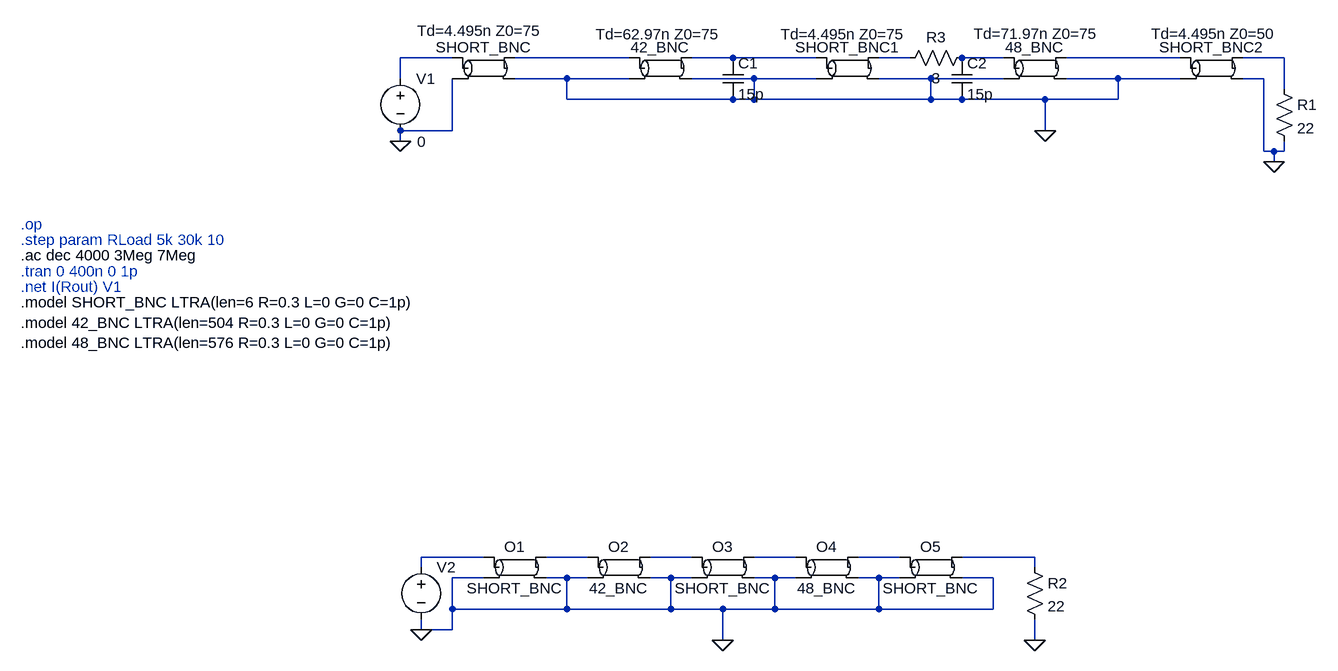
[diagram p0: schematic 4b_matched.asc]
4b_matched.asc, the LTspice schematic file:
Version 4.1
SHEET 1 2820 1172
WIRE 1488 256 1408 256
WIRE 1760 256 1584 256
WIRE 1920 256 1856 256
WIRE 2048 256 1920 256
WIRE 2192 256 2144 256
WIRE 2336 256 2272 256
WIRE 2608 256 2432 256
WIRE 2768 256 2704 256
WIRE 1408 288 1408 256
WIRE 1664 288 1584 288
WIRE 1760 288 1664 288
WIRE 1952 288 1856 288
WIRE 2048 288 1952 288
WIRE 2224 288 2144 288
WIRE 2336 288 2224 288
WIRE 2512 288 2432 288
WIRE 2608 288 2512 288
WIRE 2736 288 2704 288
WIRE 2768 304 2768 256
WIRE 1664 320 1664 288
WIRE 1920 320 1664 320
WIRE 1952 320 1952 288
WIRE 1952 320 1920 320
WIRE 2224 320 2224 288
WIRE 2224 320 1952 320
WIRE 2272 320 2224 320
WIRE 2400 320 2272 320
WIRE 2512 320 2512 288
WIRE 2512 320 2400 320
WIRE 1488 368 1488 288
WIRE 1488 368 1408 368
WIRE 2400 368 2400 320
WIRE 1408 384 1408 368
WIRE 2736 400 2736 288
WIRE 2752 400 2736 400
WIRE 2768 400 2768 384
WIRE 2768 400 2752 400
WIRE 2752 416 2752 400
WIRE 1536 1024 1440 1024
WIRE 1696 1024 1632 1024
WIRE 1856 1024 1792 1024
WIRE 2016 1024 1952 1024
WIRE 2176 1024 2112 1024
WIRE 2384 1024 2272 1024
WIRE 1440 1040 1440 1024
WIRE 2384 1040 2384 1024
WIRE 1536 1056 1488 1056
WIRE 1664 1056 1632 1056
WIRE 1696 1056 1664 1056
WIRE 1824 1056 1792 1056
WIRE 1856 1056 1824 1056
WIRE 1984 1056 1952 1056
WIRE 2016 1056 1984 1056
WIRE 2144 1056 2112 1056
WIRE 2176 1056 2144 1056
WIRE 2320 1056 2272 1056
WIRE 1488 1104 1488 1056
WIRE 1664 1104 1664 1056
WIRE 1664 1104 1488 1104
WIRE 1824 1104 1824 1056
WIRE 1824 1104 1664 1104
WIRE 1904 1104 1824 1104
WIRE 1984 1104 1984 1056
WIRE 1984 1104 1904 1104
WIRE 2144 1104 2144 1056
WIRE 2144 1104 1984 1104
WIRE 2320 1104 2320 1056
WIRE 2320 1104 2144 1104
WIRE 1440 1136 1440 1120
WIRE 1488 1136 1488 1104
WIRE 1488 1136 1440 1136
WIRE 1904 1152 1904 1104
WIRE 2384 1152 2384 1120
FLAG 1408 384 0
FLAG 2752 416 0
FLAG 2400 368 0
FLAG 1904 1152 0
FLAG 1440 1136 0
FLAG 2384 1152 0
SYMBOL tline 1808 272 R0
WINDOW 3 -3 -68 Top 2
SYMATTR Value Td=62.97n Z0=75
SYMATTR InstName 42_BNC
SYMBOL Voltage 1408 272 R0
WINDOW 3 26 113 Left 2
SYMATTR Value 0
SYMATTR InstName V1
SYMATTR SpiceLine Rser=69
SYMATTR Value2 AC .93
SYMBOL tline 2384 272 R0
WINDOW 3 3 -69 Top 2
SYMATTR Value Td=71.97n Z0=75
SYMATTR InstName 48_BNC
SYMBOL Res 2752 288 R0
SYMATTR InstName R1
SYMATTR Value 22
SYMBOL tline 1536 272 R0
WINDOW 3 -5 -73 Top 2
SYMATTR Value Td=4.495n Z0=75
SYMATTR InstName SHORT_BNC
SYMBOL tline 2096 272 R0
WINDOW 3 -6 -68 Top 2
SYMATTR Value Td=4.495n Z0=75
SYMATTR InstName SHORT_BNC1
SYMBOL tline 2656 272 R0
WINDOW 3 4 -69 Top 2
SYMATTR Value Td=4.495n Z0=50
SYMATTR InstName SHORT_BNC2
SYMBOL ltline 1584 1040 R0
SYMATTR InstName O1
SYMATTR Value SHORT_BNC
SYMBOL ltline 1744 1040 R0
SYMATTR InstName O2
SYMATTR Value 42_BNC
SYMBOL ltline 1904 1040 R0
SYMATTR InstName O3
SYMATTR Value SHORT_BNC
SYMBOL ltline 2064 1040 R0
SYMATTR InstName O4
SYMATTR Value 48_BNC
SYMBOL ltline 2224 1040 R0
SYMATTR InstName O5
SYMATTR Value SHORT_BNC
SYMBOL Voltage 1440 1024 R0
SYMATTR InstName V2
SYMATTR Value ""
SYMATTR Value2 AC 1
SYMATTR SpiceLine Rser=50
SYMBOL Res 2368 1024 R0
SYMATTR InstName R2
SYMATTR Value 22
SYMBOL Cap 1904 256 R0
SYMATTR InstName C1
SYMATTR Value 15p
SYMBOL Cap 2256 256 R0
SYMATTR InstName C2
SYMATTR Value 15p
SYMBOL res 2288 240 R90
WINDOW 0 0 56 VBottom 2
WINDOW 3 32 56 VTop 2
SYMATTR InstName R3
SYMATTR Value 3
TEXT 824 512 Left 2 ;.op
TEXT 824 536 Left 2 ;.step param RLoad 5k 30k 10
TEXT 824 560 Left 2 !.ac dec 4000 3Meg 7Meg
TEXT 824 584 Left 2 ;.tran 0 400n 0 1p
TEXT 824 608 Left 2 ;.net I(Rout) V1
TEXT 824 632 Left 2 !.model SHORT_BNC LTRA(len=6 R=0.3 L=0 G=0 C=1p)\n.model 42_BNC LTRA(len=504 R=0.3 L=0 G=0 C=1p)\n.model 48_BNC LTRA(len=576 R=0.3 L=0 G=0 C=1p)

The netlist it stands for:
* 4b_matched.asc
T§42_BNC N002 0 N003 0 Td=62.97n Z0=75
V1 N001 0 0 AC .93 Rser=69
T§48_BNC N005 0 N006 0 Td=71.97n Z0=75
R1 N007 0 22
T§SHORT_BNC N001 0 N002 0 Td=4.495n Z0=75
T§SHORT_BNC1 N003 0 N004 0 Td=4.495n Z0=75
T§SHORT_BNC2 N006 0 N007 0 Td=4.495n Z0=50
O1 N008 0 N009 0 SHORT_BNC
O2 N009 0 N010 0 42_BNC
O3 N010 0 N011 0 SHORT_BNC
O4 N011 0 N012 0 48_BNC
O5 N012 0 N013 0 SHORT_BNC
V2 N008 0 AC 1 Rser=50
R2 N013 0 22
C1 N003 0 15p
C2 N005 0 15p
R3 N005 N004 3
* .op
* .step param RLoad 5k 30k 10
.ac dec 4000 3Meg 7Meg
* .tran 0 400n 0 1p
* .net I(Rout) V1
.model SHORT_BNC LTRA(len=6 R=0.3 L=0 G=0 C=1p)
.model 42_BNC LTRA(len=504 R=0.3 L=0 G=0 C=1p)
.model 48_BNC LTRA(len=576 R=0.3 L=0 G=0 C=1p)
.backanno
.end